# EAGLE schematic cpu (EAGLE 4.15), part 2 of 2
## Sheet 12 of 16
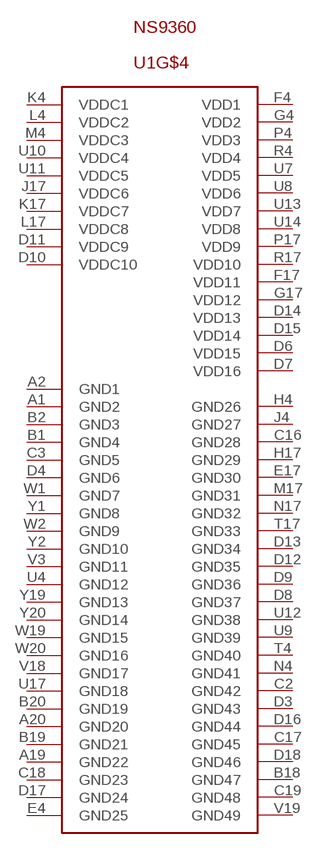
[diagram p12: schematic, sheet 12, part 1 of 2]
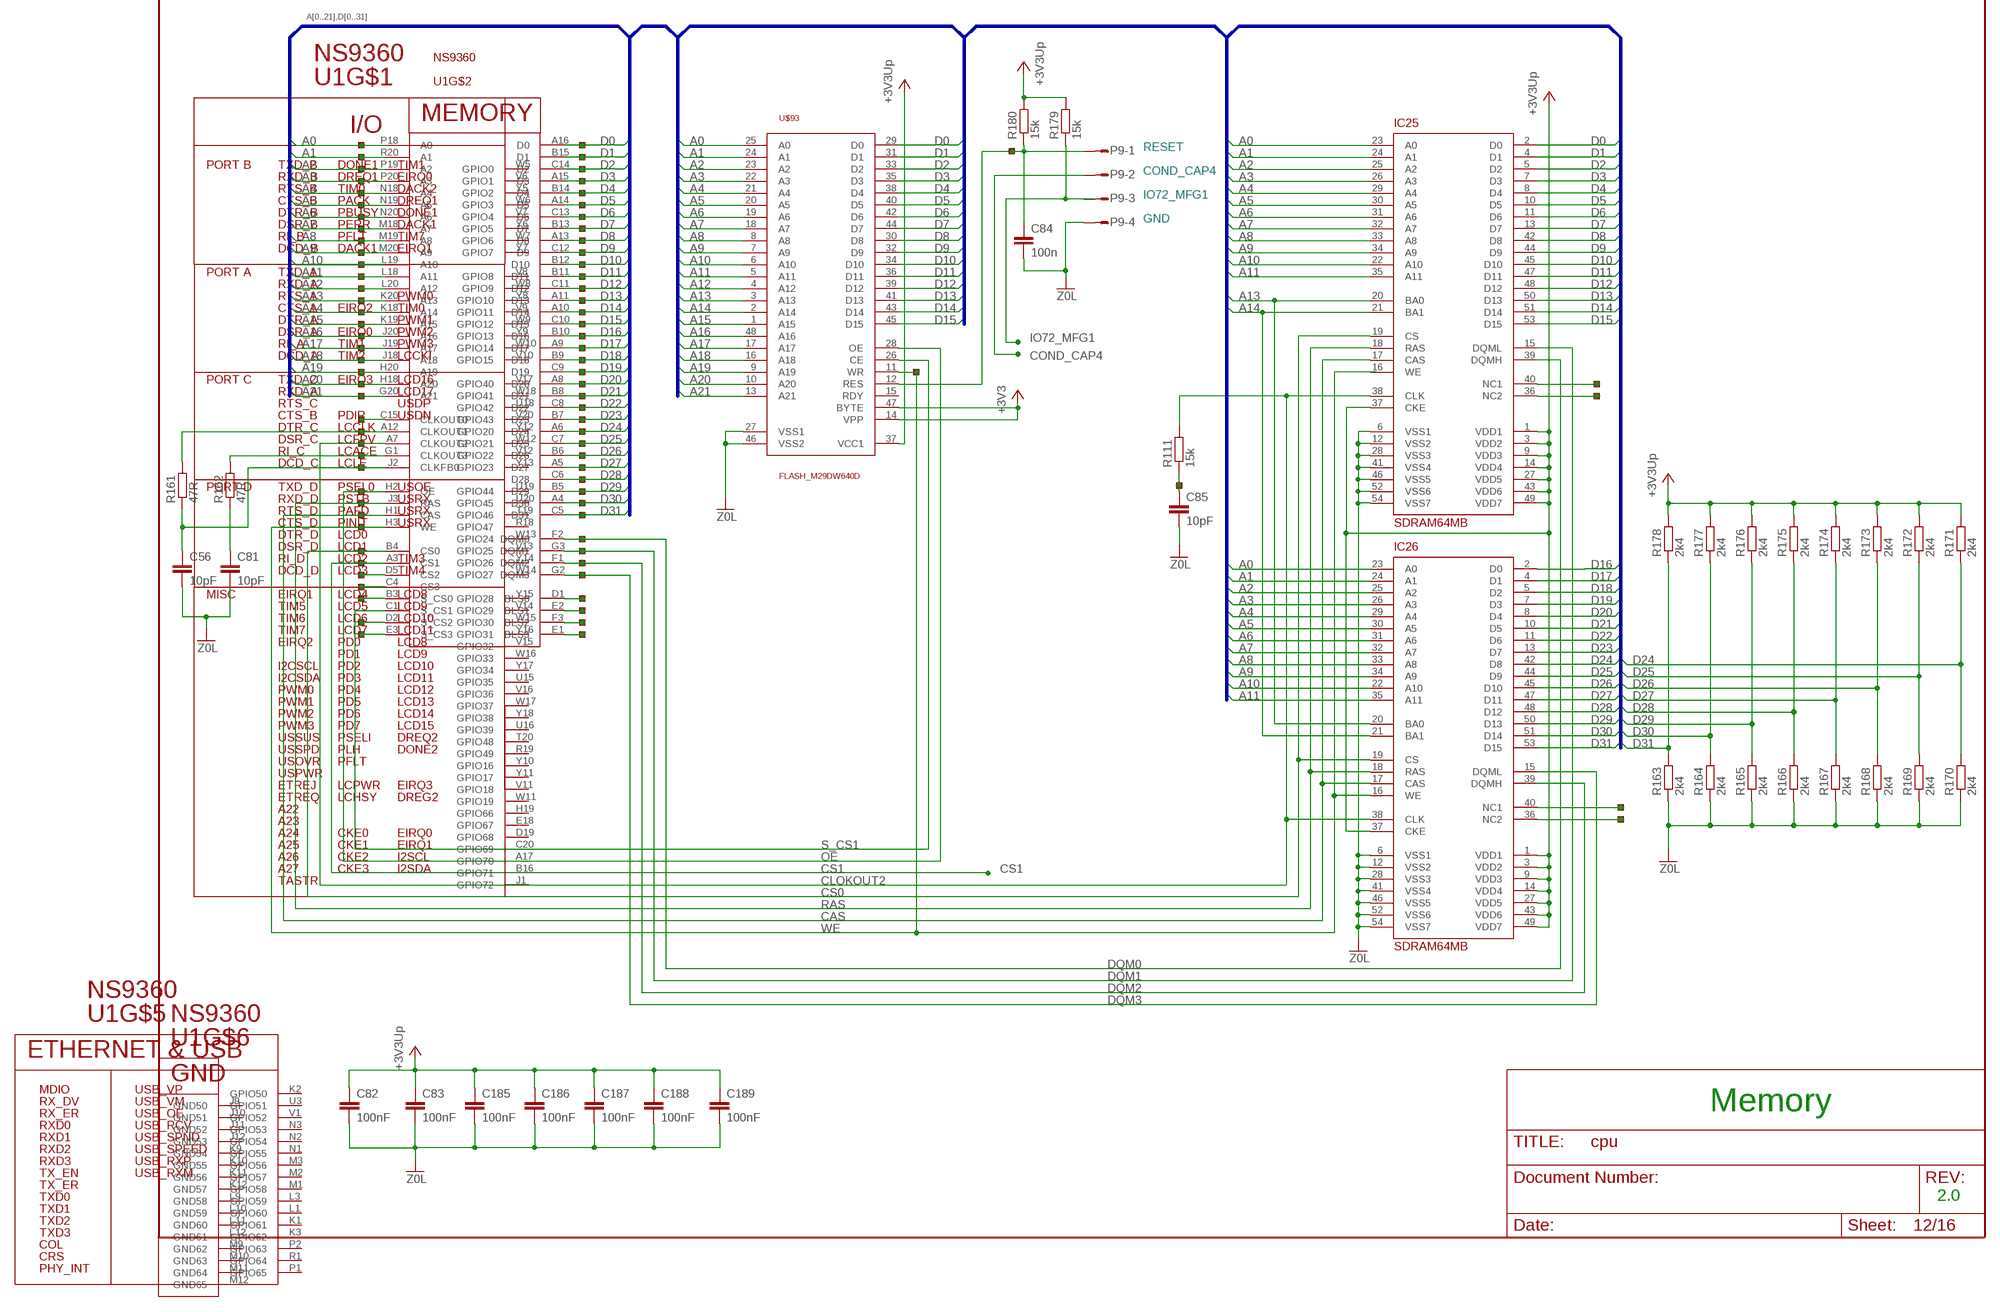
[diagram p13: schematic, sheet 12, part 2 of 2]

### Parts
C56  10pF  C-EUC0805K  [C0805K]
C81  10pF  C-EUC0805K  [C0805K]
C82  100nF  C-EUC0805K  [C0805K]
C83  100nF  C-EUC0805K  [C0805K]
C84  100n  C-EUC0805K  [C0805K]
C85  10pF  C-EUC0805K  [C0805K]
C185  100nF  C-EUC0805K  [C0805K]
C186  100nF  C-EUC0805K  [C0805K]
C187  100nF  C-EUC0805K  [C0805K]
C188  100nF  C-EUC0805K  [C0805K]
C189  100nF  C-EUC0805K  [C0805K]
IC25  SDRAM64MB  [TSOP54]
IC26  SDRAM64MB  [TSOP54]
P9  L04P  [L04P]
R111  15k  R-EU_R0805W  [R0805W]
R161  47R  R-EU_R0805W  [R0805W]
R162  47R  R-EU_R0805W  [R0805W]
R163  2k4  R-EU_R0805W  [R0805W]
R164  2k4  R-EU_R0805W  [R0805W]
R165  2k4  R-EU_R0805W  [R0805W]
R166  2k4  R-EU_R0805W  [R0805W]
R167  2k4  R-EU_R0805W  [R0805W]
R168  2k4  R-EU_R0805W  [R0805W]
R169  2k4  R-EU_R0805W  [R0805W]
R170  2k4  R-EU_R0805W  [R0805W]
R171  2k4  R-EU_R0805W  [R0805W]
R172  2k4  R-EU_R0805W  [R0805W]
R173  2k4  R-EU_R0805W  [R0805W]
R174  2k4  R-EU_R0805W  [R0805W]
R175  2k4  R-EU_R0805W  [R0805W]
R176  2k4  R-EU_R0805W  [R0805W]
R177  2k4  R-EU_R0805W  [R0805W]
R178  2k4  R-EU_R0805W  [R0805W]
R179  15k  R-EU_R0805W  [R0805W]
R180  15k  R-EU_R0805W  [R0805W]
U$93  FLASH_M29DW640D  [TSOP48]
U$149  TESTPAD  [TESTPAD]
U$162  TESTPAD  [TESTPAD]
U$258  TESTPAD  [TESTPAD]
U$263  TESTPAD  [TESTPAD]
U$265  TESTPAD  [TESTPAD]
U$273  TESTPAD  [TESTPAD]
U$275  TESTPAD  [TESTPAD]
U$284  TESTPAD  [TESTPAD]
U$303  TESTPAD  [TESTPAD]
U$304  TESTPAD  [TESTPAD]
U$305  TESTPAD  [TESTPAD]
U$306  TESTPAD  [TESTPAD]
U$309  TESTPAD  [TESTPAD]
U$333  TESTPAD  [TESTPAD]
U$371  TESTPAD  [TESTPAD]
U$372  TESTPAD  [TESTPAD]
U$376  TESTPAD  [TESTPAD]
U$382  TESTPAD  [TESTPAD]
U$385  TESTPAD  [TESTPAD]
U$399  TESTPAD  [TESTPAD]
U$402  TESTPAD  [TESTPAD]
U$403  TESTPAD  [TESTPAD]
U$404  TESTPAD  [TESTPAD]
U$405  TESTPAD  [TESTPAD]
U$406  TESTPAD  [TESTPAD]
U$407  TESTPAD  [TESTPAD]
U$412  TESTPAD  [TESTPAD]
U$423  TESTPAD  [TESTPAD]
U$424  TESTPAD  [TESTPAD]
U$425  TESTPAD  [TESTPAD]
U$426  TESTPAD  [TESTPAD]
U$427  TESTPAD  [TESTPAD]
U$428  TESTPAD  [TESTPAD]
U$429  TESTPAD  [TESTPAD]
U$430  TESTPAD  [TESTPAD]
U$431  TESTPAD  [TESTPAD]
U$432  TESTPAD  [TESTPAD]
U$433  TESTPAD  [TESTPAD]
U$434  TESTPAD  [TESTPAD]
U$435  TESTPAD  [TESTPAD]
U$441  TESTPAD  [TESTPAD]
U$447  TESTPAD  [TESTPAD]
U$448  TESTPAD  [TESTPAD]
U$449  TESTPAD  [TESTPAD]
U$453  TESTPAD  [TESTPAD]
U$454  TESTPAD  [TESTPAD]
U$457  TESTPAD  [TESTPAD]
U$458  TESTPAD  [TESTPAD]
U$459  TESTPAD  [TESTPAD]
U$462  TESTPAD  [TESTPAD]
U$469  TESTPAD  [TESTPAD]
U$470  TESTPAD  [TESTPAD]
U$471  TESTPAD  [TESTPAD]
U$472  TESTPAD  [TESTPAD]
U$473  TESTPAD  [TESTPAD]
U$474  TESTPAD  [TESTPAD]
U$476  TESTPAD  [TESTPAD]
U$481  TESTPAD  [TESTPAD]
U$482  TESTPAD  [TESTPAD]
U$483  TESTPAD  [TESTPAD]
U$486  TESTPAD  [TESTPAD]
U$487  TESTPAD  [TESTPAD]
U$488  TESTPAD  [TESTPAD]
U$489  TESTPAD  [TESTPAD]
U$490  TESTPAD  [TESTPAD]
U$493  TESTPAD  [TESTPAD]
U$510  TESTPAD  [TESTPAD]
U$554  TESTPAD  [TESTPAD]
U$556  TESTPAD  [TESTPAD]
U$569  TESTPAD  [TESTPAD]
U$570  TESTPAD  [TESTPAD]
U$571  TESTPAD  [TESTPAD]
U$572  TESTPAD  [TESTPAD]
U$573  TESTPAD  [TESTPAD]
U$574  TESTPAD  [TESTPAD]
U$575  TESTPAD  [TESTPAD]
U$588  TESTPAD  [TESTPAD]
U$589  TESTPAD  [TESTPAD]
U$590  TESTPAD  [TESTPAD]
U$591  TESTPAD  [TESTPAD]
U$592  TESTPAD  [TESTPAD]
U$593  TESTPAD  [TESTPAD]
U$594  TESTPAD  [TESTPAD]
U$595  TESTPAD  [TESTPAD]
U$596  TESTPAD  [TESTPAD]

### Nets
0V: C82.2 C83.2 C84.2 C185.2 C186.2 C187.2 C188.2 C189.2 IC25.6(VSS1) IC25.12(VSS2) IC25.28(VSS3) IC25.41(VSS4) IC25.46(VSS5) IC25.52(VSS6) IC25.54(VSS7) IC26.6(VSS1) IC26.12(VSS2) IC26.28(VSS3) IC26.41(VSS4) IC26.46(VSS5) IC26.52(VSS6) IC26.54(VSS7) P9.4 R163.1 R164.1 R165.1 R166.1 R167.1 R168.1 R169.1 R170.1 U$93.27(VSS1) U$93.46(VSS2) ; supply symbol labelled Z0L ; also sheet 2,3,4,5,6,7,8,9,10,11,13,14,15,16
+3V3: C82.1 C83.1 C185.1 C186.1 C187.1 C188.1 C189.1 IC25.1(VDD1) IC25.3(VDD2) IC25.9(VDD3) IC25.14(VDD4) IC25.27(VDD5) IC25.37(CKE) IC25.43(VDD6) IC25.49(VDD7) IC26.1(VDD1) IC26.3(VDD2) IC26.9(VDD3) IC26.14(VDD4) IC26.27(VDD5) IC26.37(CKE) IC26.43(VDD6) IC26.49(VDD7) R171.2 R172.2 R173.2 R174.2 R175.2 R176.2 R177.2 R178.2 R179.2 R180.2 U$93.14(VPP) U$93.37(VCC1) U$93.47(BYTE) ; supply symbol labelled +3V3Up ; also sheet 2,3,4,5,6,7,10,11,13,14,15,16
A0: IC25.23(A0) IC26.23(A0) U1.P18(A0) U$93.25(A0) U$441.1
A1: IC25.24(A1) IC26.24(A1) U1.R20(A1) U$93.24(A1) U$435.1
A2: IC25.25(A2) IC26.25(A2) U1.P19(A2) U$93.23(A2) U$434.1
A3: IC25.26(A3) IC26.26(A3) U1.P20(A3) U$93.22(A3) U$433.1
A4: IC25.29(A4) IC26.29(A4) U1.N18(A4) U$93.21(A4) U$432.1
A5: IC25.30(A5) IC26.30(A5) U1.N19(A5) U$93.20(A5) U$431.1
A6: IC25.31(A6) IC26.31(A6) U1.N20(A6) U$93.19(A6) U$430.1
A7: IC25.32(A7) IC26.32(A7) U1.M18(A7) U$93.18(A7) U$429.1
A8: IC25.33(A8) IC26.33(A8) U1.M19(A8) U$93.8(A8) U$428.1
A9: IC25.34(A9) IC26.34(A9) U1.M20(A9) U$93.7(A9) U$427.1
A10: IC25.22(A10) IC26.22(A10) U1.L19(A10) U$93.6(A10) U$426.1
A11: IC25.35(A11) IC26.35(A11) U1.L18(A11) U$93.5(A11) U$425.1
A12: U1.L20(A12) U$93.4(A12) U$424.1
A13: IC25.20(BA0) IC26.20(BA0) U1.K20(A13) U$93.3(A13) U$423.1
A14: IC25.21(BA1) IC26.21(BA1) U1.K18(A14) U$93.2(A14) U$412.1
A15: U1.K19(A15) U$93.1(A15) U$407.1
A16: U1.J20(A16) U$93.48(A16) U$406.1
A17: U1.J19(A17) U$93.17(A17) U$405.1
A18: U1.J18(A18) U$93.16(A18) U$404.1
A19: U1.H20(A19) U$93.9(A19) U$403.1
A20: U1.H18(A20) U$93.10(A20) U$402.1
A21: U1.G20(A21) U$93.13(A21) U$399.1
CAS: IC25.17(CAS) IC26.17(CAS) U1.H1(CAS) U$306.1
CLOKOUT2: IC25.38(CLK) IC26.38(CLK) R111.2 U1.A7(CLKOUT2) U$382.1
COND_CAP4: P9.2 ; also sheet 4,5
CS0: IC25.19(CS) IC26.19(CS) U1.B4(CS0) U$304.1
CS1: U1.A3(CS1) U$303.1 ; also sheet 5
D0: IC25.2(D0) U1.A16(D0) U$93.29(D0) U$447.1
D1: IC25.4(D1) U1.B15(D1) U$93.31(D1) U$489.1
D2: IC25.5(D2) U1.C14(D2) U$93.33(D2) U$488.1
D3: IC25.7(D3) U1.A15(D3) U$93.35(D3) U$487.1
D4: IC25.8(D4) U1.B14(D4) U$93.38(D4) U$486.1
D5: IC25.10(D5) U1.A14(D5) U$93.40(D5) U$483.1
D6: IC25.11(D6) U1.C13(D6) U$93.42(D6) U$482.1
D7: IC25.13(D7) U1.B13(D7) U$93.44(D7) U$481.1
D8: IC25.42(D8) U1.A13(D8) U$93.30(D8) U$476.1
D9: IC25.44(D9) U1.C12(D9) U$93.32(D9) U$474.1
D10: IC25.45(D10) U1.B12(D10) U$93.34(D10) U$473.1
D11: IC25.47(D11) U1.B11(D11) U$93.36(D11) U$472.1
D12: IC25.48(D12) U1.C11(D12) U$93.39(D12) U$471.1
D13: IC25.50(D13) U1.A11(D13) U$93.41(D13) U$470.1
D14: IC25.51(D14) U1.A10(D14) U$93.43(D14) U$469.1
D15: IC25.53(D15) U1.C10(D15) U$93.45(D15) U$462.1
D16: IC26.2(D0) U1.B10(D16) U$459.1
D17: IC26.4(D1) U1.A9(D17) U$458.1
D18: IC26.5(D2) U1.B9(D18) U$457.1
D19: IC26.7(D3) U1.C9(D19) U$454.1
D20: IC26.8(D4) U1.A8(D20) U$453.1
D21: IC26.10(D5) U1.B8(D21) U$449.1
D22: IC26.11(D6) U1.C8(D22) U$448.1
D23: IC26.13(D7) U1.B7(D23) U$490.1
D24: IC26.42(D8) R170.2 R171.1 U1.A6(D24) U$554.1
D25: IC26.44(D9) R169.2 R172.1 U1.C7(D25) U$556.1
D26: IC26.45(D10) R168.2 R173.1 U1.B6(D26) U$569.1
D27: IC26.47(D11) R167.2 R174.1 U1.A5(D27) U$570.1
D28: IC26.48(D12) R166.2 R175.1 U1.C6(D28) U$571.1
D29: IC26.50(D13) R165.2 R176.1 U1.B5(D29) U$572.1
D30: IC26.51(D14) R164.2 R177.1 U1.A4(D30) U$573.1
D31: IC26.53(D15) R163.2 R178.1 U1.C5(D31) U$574.1
DQM0: IC25.39(DQMH) U1.F2(DQM0) U$575.1
DQM1: IC25.15(DQML) U1.G3(DQM1) U$588.1
DQM2: IC26.39(DQMH) U1.F1(DQM2) U$589.1
DQM3: IC26.15(DQML) U1.G2(DQM3) U$590.1
IO72_MFG1: P9.3 R179.1 ; also sheet 5
N$176: R111.1 U$309.1
N$204: C84.1 P9.1 R180.1 U$93.12(RES) U$596.1
N$205: C81.1 R162.1
N$217: R161.1 U1.J2(CLKFB0) U$372.1
N$220: R161.2 U1.A12(CLKOUT1) U$385.1
N$221: R162.2 U1.G1(CLKOUT3) U$376.1
N$359: U1.C15(CLKOUT0) U$275.1
N$360: U1.D5(CS2) U$284.1
N$361: U1.C4(CS3) U$273.1
N$362: U1.B3(S_CS0) U$265.1
N$363: U1.D2(S_CS2) U$263.1
N$364: U1.E3(S_CS3) U$258.1
N$365: U1.D1(BLS0) U$591.1
N$366: U1.E2(BLS1) U$592.1
N$367: U1.F3(BLS2) U$593.1
N$368: U1.E1(BLS3) U$594.1
N$369: IC26.40(NC1) U$493.1
N$370: IC26.36(NC2) U$510.1
N$371: IC25.40(NC1) U$149.1
N$372: IC25.36(NC2) U$162.1
OE: U1.H2(OE) U$93.28(OE) U$371.1
RAS: IC25.18(RAS) IC26.18(RAS) U1.J3(RAS) U$333.1
S_CS1: U1.C1(S_CS1) U$93.26(CE)
WE: IC26.16(WE) U1.H3(WE) U$93.11(WR) U$305.1 U$595.1
Unconnected: C56.1 C56.2 C81.2 C85.1 C85.2 IC25.16(WE) U$93.15(RDY)

### Buses
A[0..21],D[0..31]

### Notes on the sheet
- RESET
- COND_CAP4
- IO72_MFG1
- GND
- Memory
- 2.0

## Sheet 13 of 16
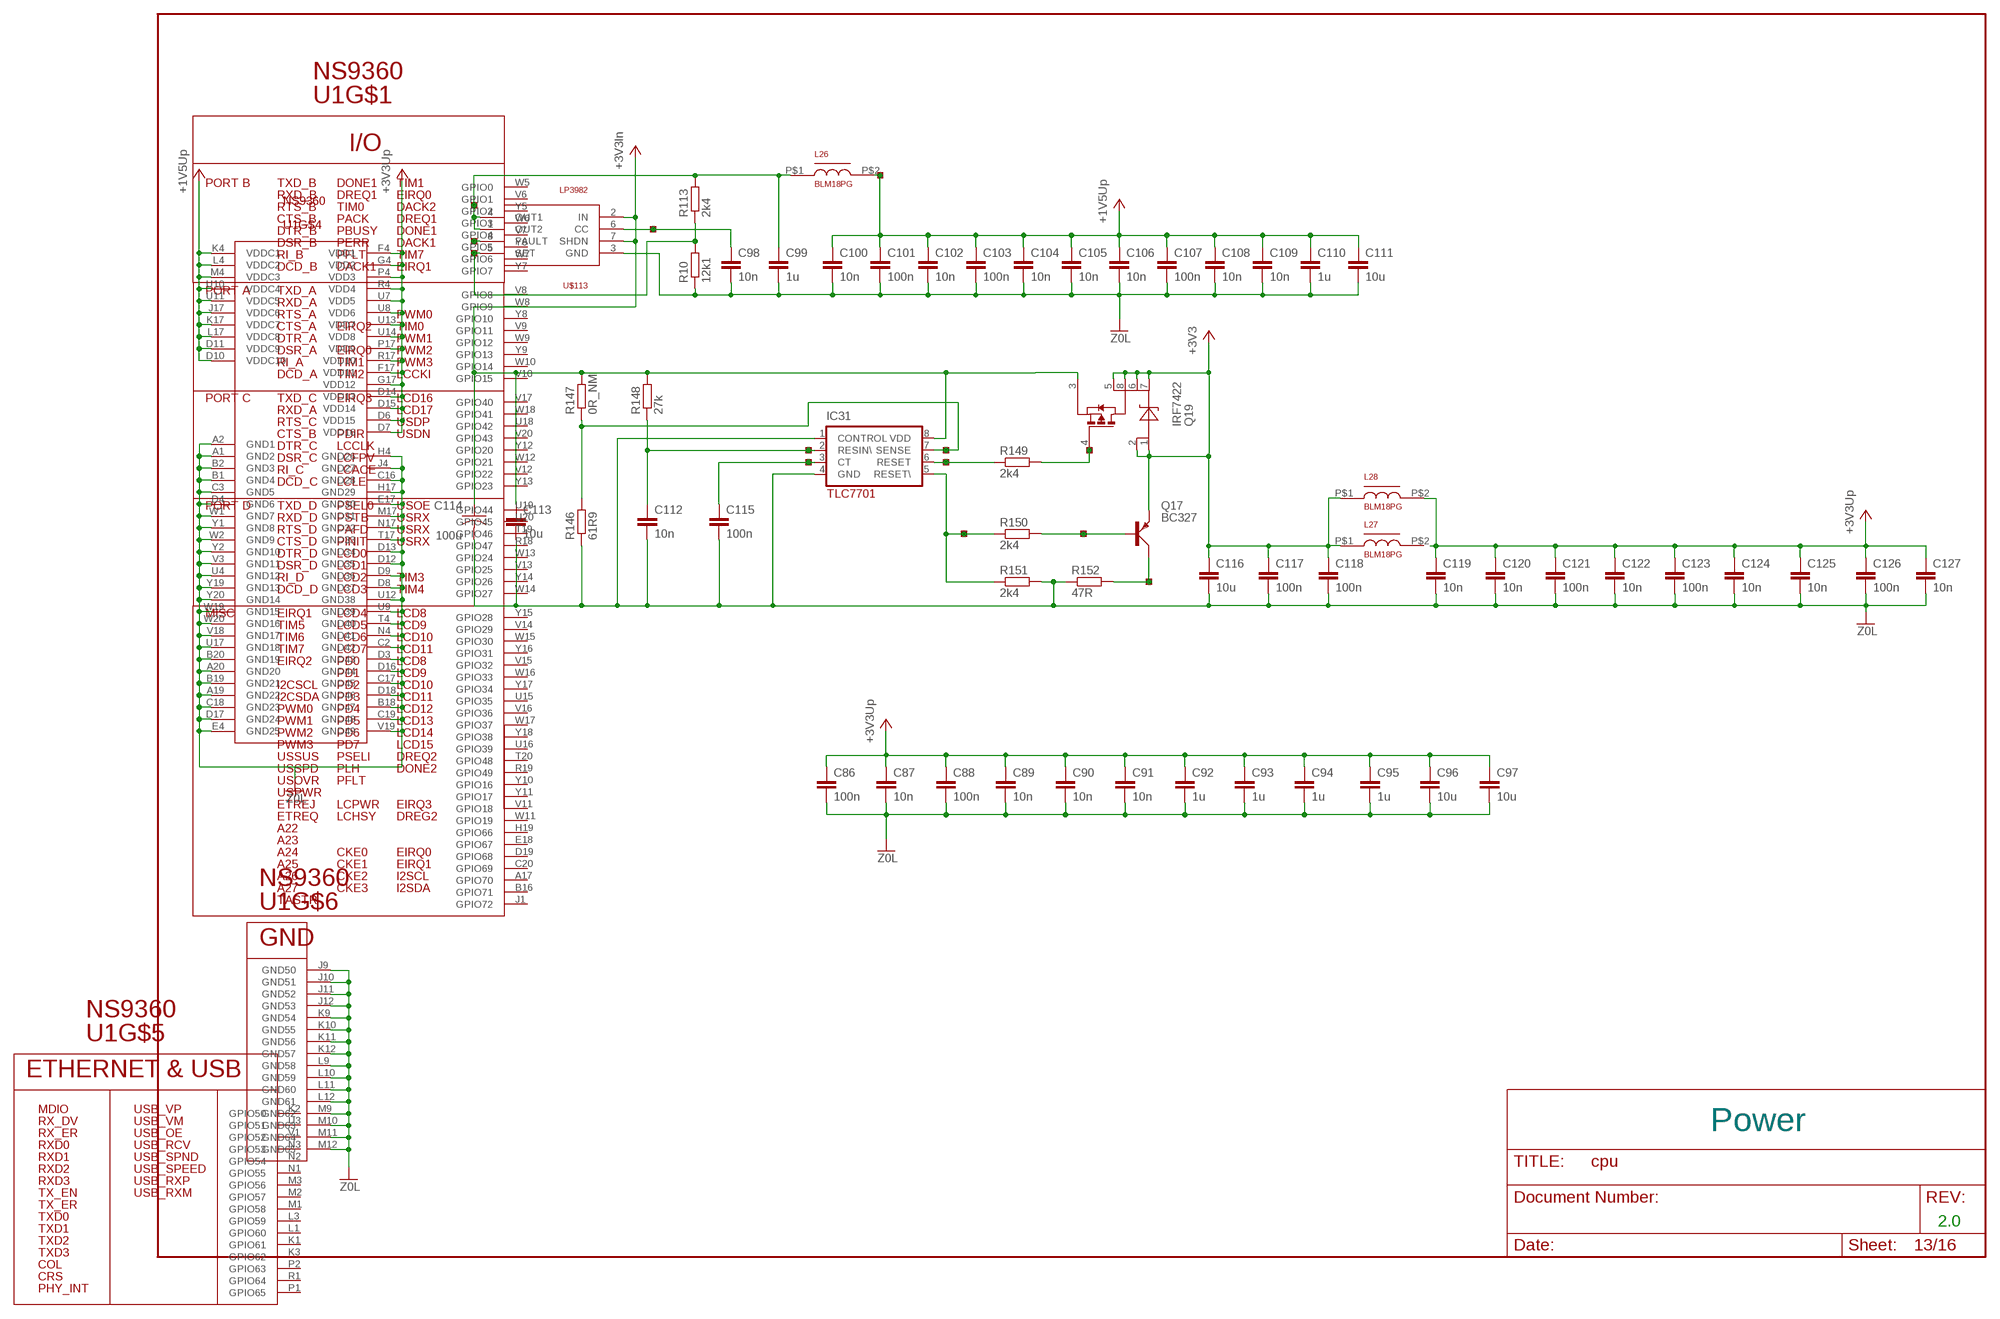
[diagram p14: schematic, sheet 13]

### Parts
C86  100n  C-EUC0805K  [C0805K]
C87  10n  C-EUC0805K  [C0805K]
C88  100n  C-EUC0805K  [C0805K]
C89  10n  C-EUC0805K  [C0805K]
C90  10n  C-EUC0805K  [C0805K]
C91  10n  C-EUC0805K  [C0805K]
C92  1u  C-EUC0805K  [C0805K]
C93  1u  C-EUC0805K  [C0805K]
C94  1u  C-EUC0805K  [C0805K]
C95  1u  C-EUC0805K  [C0805K]
C96  10u  C-EUC0805K  [C0805K]
C97  10u  C-EUC0805K  [C0805K]
C98  10n  C-EUC0805K  [C0805K]
C99  1u  C-EUC0805K  [C0805K]
C100  10n  C-EUC0805K  [C0805K]
C101  100n  C-EUC0805K  [C0805K]
C102  10n  C-EUC0805K  [C0805K]
C103  100n  C-EUC0805K  [C0805K]
C104  10n  C-EUC0805K  [C0805K]
C105  10n  C-EUC0805K  [C0805K]
C106  10n  C-EUC0805K  [C0805K]
C107  100n  C-EUC0805K  [C0805K]
C108  10n  C-EUC0805K  [C0805K]
C109  10n  C-EUC0805K  [C0805K]
C110  1u  C-EUC0805K  [C0805K]
C111  10u  C-EUC0805K  [C0805K]
C112  10n  C-EUC0805K  [C0805K]
C113  10u  C-EUC0805K  [C0805K]
C114  100u  CAP2.5  [CAP2.5]
C115  100n  C-EUC0805K  [C0805K]
C116  10u  C-EUC0805K  [C0805K]
C117  100n  C-EUC0805K  [C0805K]
C118  100n  C-EUC0805K  [C0805K]
C119  10n  C-EUC0805K  [C0805K]
C120  10n  C-EUC0805K  [C0805K]
C121  100n  C-EUC0805K  [C0805K]
C122  10n  C-EUC0805K  [C0805K]
C123  100n  C-EUC0805K  [C0805K]
C124  10n  C-EUC0805K  [C0805K]
C125  10n  C-EUC0805K  [C0805K]
C126  100n  C-EUC0805K  [C0805K]
C127  10n  C-EUC0805K  [C0805K]
IC31  TLC7701  TLC77XX  [SO8]
L26  BLM18PG  IND_BLM  [IND_BLM]
L27  BLM18PG  IND_BLM  [IND_BLM]
L28  BLM18PG  IND_BLM  [IND_BLM]
Q17  BC327  [SOT54A]
Q19  IRF7422  [SO8]
R10  12k1  R-EU_R0805W  [R0805W]
R113  2k4  R-EU_R0805W  [R0805W]
R146  61R9  R-EU_R0805W  [R0805W]
R147  0R_NM  R-EU_R0805W  [R0805W]
R148  27k  R-EU_R0805W  [R0805W]
R149  2k4  R-EU_R0805W  [R0805W]
R150  2k4  R-EU_R0805W  [R0805W]
R151  2k4  R-EU_R0805W  [R0805W]
R152  47R  R-EU_R0805W  [R0805W]
U$113  LP3982  [MSOP8]
U$597  TESTPAD  [TESTPAD]
U$598  TESTPAD  [TESTPAD]
U$599  TESTPAD  [TESTPAD]
U$600  TESTPAD  [TESTPAD]
U$601  TESTPAD  [TESTPAD]
U$602  TESTPAD  [TESTPAD]
U$603  TESTPAD  [TESTPAD]
U$604  TESTPAD  [TESTPAD]
U$605  TESTPAD  [TESTPAD]
U$606  TESTPAD  [TESTPAD]
U$607  TESTPAD  [TESTPAD]
U$608  TESTPAD  [TESTPAD]
U$609  TESTPAD  [TESTPAD]

### Nets
0V: C86.2 C93.2 C94.2 C95.2 C96.2 C97.2 C99.2 C100.2 C101.2 C102.2 C103.2 C104.2 C105.2 C106.2 C107.2 C108.2 C109.2 C110.2 C111.2 C112.2 C113.2 C114.2 C115.2 C116.2 C117.2 C118.2 C119.2 C120.2 C121.2 C122.2 C123.2 C124.2 C125.2 C126.2 C127.2 IC31.1(CONTROL) IC31.4(GND) R10.1 R146.1 R151.2 R152.1 U1.A1(GND2) U1.A2(GND1) U1.A19(GND22) U1.A20(GND20) U1.B1(GND4) U1.B2(GND3) U1.B18(GND47) U1.B19(GND21) U1.B20(GND19) U1.C2(GND42) U1.C3(GND5) U1.C16(GND28) U1.C17(GND45) U1.C18(GND23) U1.C19(GND48) U1.D3(GND43) U1.D4(GND6) U1.D8(GND37) U1.D9(GND36) U1.D12(GND35) U1.D13(GND34) U1.D16(GND44) U1.D17(GND24) U1.D18(GND46) U1.E4(GND25) U1.E17(GND30) U1.H4(GND26) U1.H17(GND29) U1.J4(GND27) U1.J9(GND50) U1.J10(GND51) U1.J11(GND52) U1.J12(GND53) U1.K9(GND54) U1.K10(GND55) U1.K11(GND56) U1.K12(GND57) U1.L9(GND58) U1.L10(GND59) U1.L11(GND60) U1.L12(GND61) U1.M9(GND62) U1.M10(GND63) U1.M11(GND64) U1.M12(GND65) U1.M17(GND31) U1.N4(GND41) U1.N17(GND32) U1.T4(GND40) U1.T17(GND33) U1.U4(GND12) U1.U9(GND39) U1.U12(GND38) U1.U17(GND18) U1.V3(GND11) U1.V18(GND17) U1.V19(GND49) U1.W1(GND7) U1.W2(GND9) U1.W19(GND15) U1.W20(GND16) U1.Y1(GND8) U1.Y2(GND10) U1.Y19(GND13) U1.Y20(GND14) U$113.3(GND) ; supply symbol labelled Z0L ; also sheet 2,3,4,5,6,7,8,9,10,11,12,14,15,16
+3V3: C86.1 C93.1 C94.1 C95.1 C96.1 C97.1 C100.1 C101.1 C102.1 C103.1 C104.1 C105.1 C106.1 C107.1 C108.1 C109.1 C110.1 C111.1 C113.1 C114.1 C116.1 C117.1 C118.1 C119.1 C120.1 C121.1 C122.1 C123.1 C124.1 C125.1 C126.1 C127.1 IC31.8(VDD) L26.P$2 L27.P$1 L28.P$1 L28.P$2 Q17.E Q19.1 Q19.2 Q19.3 Q19.5 Q19.6 Q19.7 Q19.8 R147.2 R148.2 U1.D6(VDD15) U1.D7(VDD16) U1.D10(VDDC10) U1.D11(VDDC9) U1.D14(VDD13) U1.D15(VDD14) U1.F4(VDD1) U1.F17(VDD11) U1.G4(VDD2) U1.G17(VDD12) U1.J17(VDDC6) U1.K4(VDDC1) U1.K17(VDDC7) U1.L4(VDDC2) U1.L17(VDDC8) U1.M4(VDDC3) U1.P4(VDD3) U1.P17(VDD9) U1.R4(VDD4) U1.R17(VDD10) U1.U7(VDD5) U1.U8(VDD6) U1.U10(VDDC4) U1.U11(VDDC5) U1.U13(VDD7) U1.U14(VDD8) U$113.2(IN) U$113.7(SHDN) U$601.1 ; supply symbol labelled +3V3Up, +1V5Up, +3V3In ; also sheet 2,3,4,5,6,7,10,11,12,14,15,16
N$178: U$113.6(CC) U$600.1
N$179: C99.1 L26.P$1 R113.2 U$113.1(OUT2) U$113.4(OUT1) U$597.1
N$200: R10.2 R113.1 U$113.5(SET) U$599.1
N$201: IC31.7(SENSE) R146.2 R147.1 U$606.1
N$202: C112.1 IC31.2(RESIN\) R148.1 U$608.1
N$203: Q19.4 R149.2 U$605.1
N$206: IC31.5(RESET\) R150.1 R151.1 U$603.1
N$207: Q17.C R152.2 U$604.1
N$208: IC31.6(RESET) R149.1 U$607.1
N$209: Q17.B R150.2 U$602.1
N$210: C115.1 IC31.3(CT) U$609.1
N$354: U$113.8(FAULT) U$598.1
Unconnected: C87.1 C87.2 C88.1 C88.2 C89.1 C89.2 C90.1 C90.2 C91.1 C91.2 C92.1 C92.2 C98.1 C98.2 L27.P$2

### Notes on the sheet
- Power
- 2.0

## Sheet 14 of 16
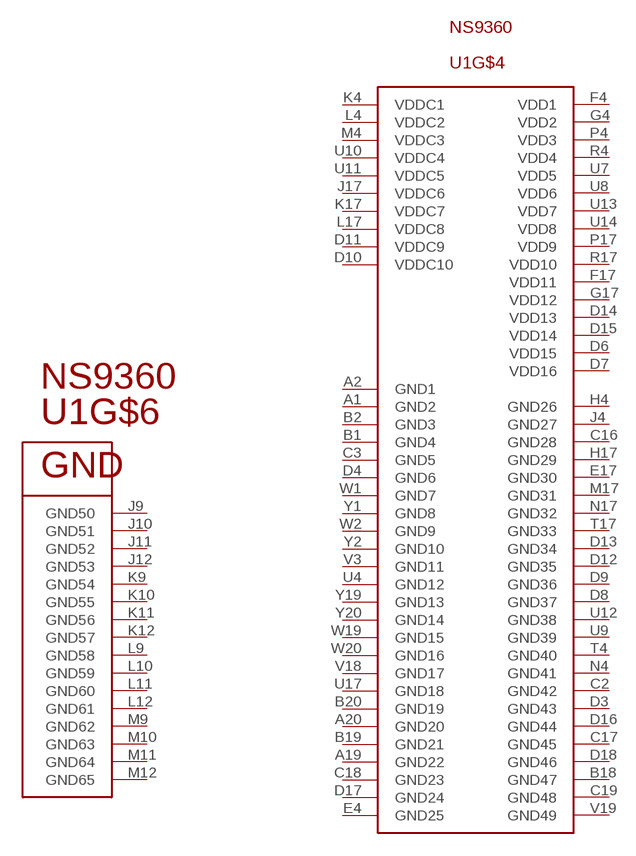
[diagram p15: schematic, sheet 14, part 1 of 2]
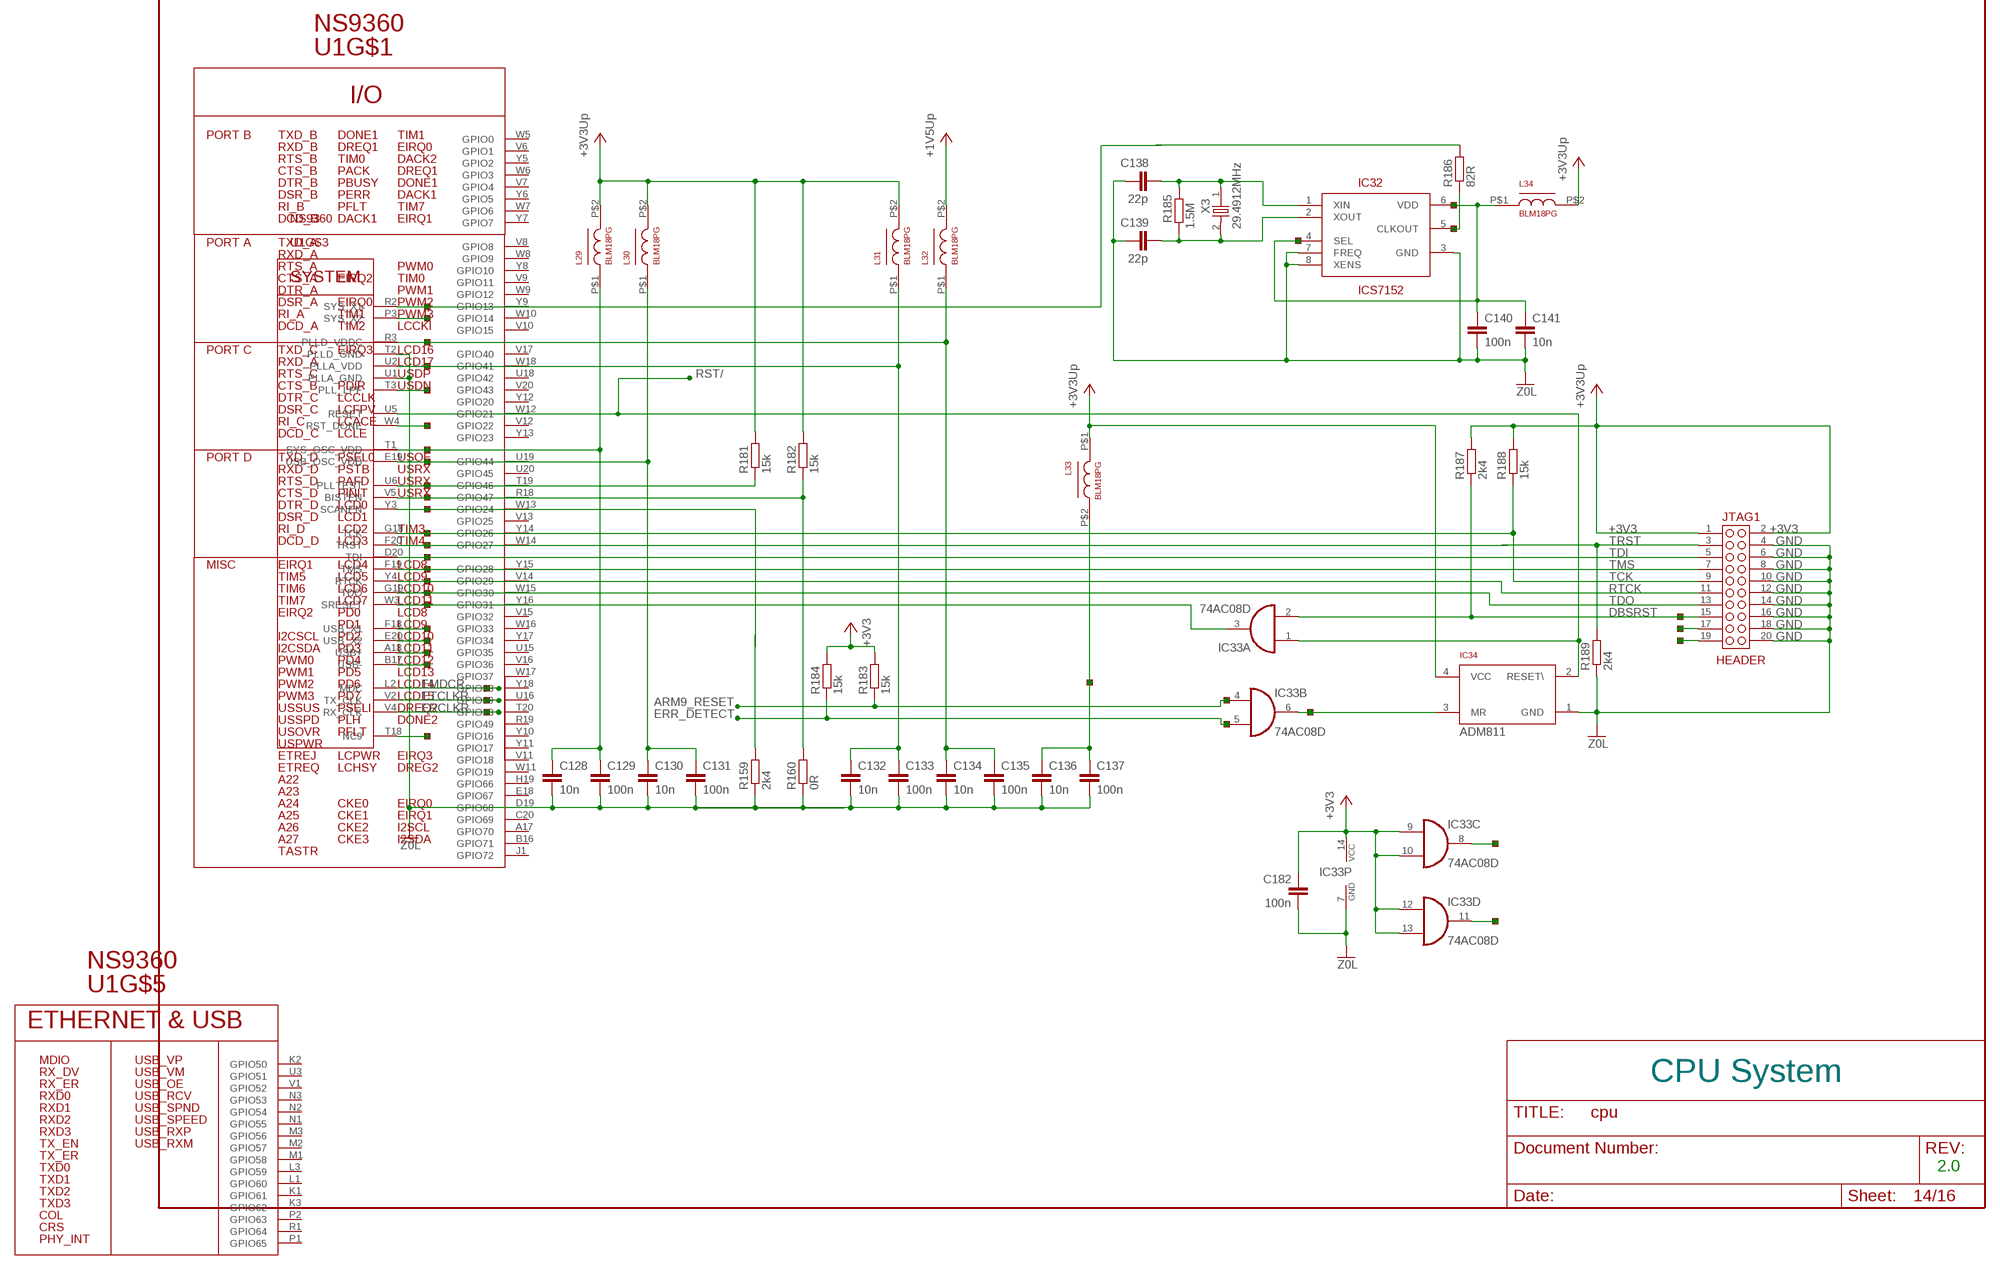
[diagram p16: schematic, sheet 14, part 2 of 2]

### Parts
C128  10n  C-EUC0805K  [C0805K]
C129  100n  C-EUC0805K  [C0805K]
C130  10n  C-EUC0805K  [C0805K]
C131  100n  C-EUC0805K  [C0805K]
C132  10n  C-EUC0805K  [C0805K]
C133  100n  C-EUC0805K  [C0805K]
C134  10n  C-EUC0805K  [C0805K]
C135  100n  C-EUC0805K  [C0805K]
C136  10n  C-EUC0805K  [C0805K]
C137  100n  C-EUC0805K  [C0805K]
C138  22p  C-EUC0805K  [C0805K]
C139  22p  C-EUC0805K  [C0805K]
C140  100n  C-EUC0805K  [C0805K]
C141  10n  C-EUC0805K  [C0805K]
C182  100n  C-EUC0805K  [C0805K]
IC32  ICS7152  [SO8]
IC33  74AC08D  [SO14]
IC34  ADM811  [ADM811]
JTAG1  HEADER  JTAG_HEADER  [JTAG_HEADER]
L29  BLM18PG  IND_BLM  [IND_BLM]
L30  BLM18PG  IND_BLM  [IND_BLM]
L31  BLM18PG  IND_BLM  [IND_BLM]
L32  BLM18PG  IND_BLM  [IND_BLM]
L33  BLM18PG  IND_BLM  [IND_BLM]
L34  BLM18PG  IND_BLM  [IND_BLM]
R159  2k4  R-EU_R0805W  [R0805W]
R160  0R  R-EU_R0805W  [R0805W]
R181  15k  R-EU_R0805W  [R0805W]
R182  15k  R-EU_R0805W  [R0805W]
R183  15k  R-EU_R0805W  [R0805W]
R184  15k  R-EU_R0805W  [R0805W]
R185  1.5M  R-EU_R0805W  [R0805W]
R186  82R  R-EU_R0805W  [R0805W]
R187  2k4  R-EU_R0805W  [R0805W]
R188  15k  R-EU_R0805W  [R0805W]
R189  2k4  R-EU_R0805W  [R0805W]
U$244  TESTPAD  [TESTPAD]
U$247  TESTPAD  [TESTPAD]
U$316  TESTPAD  [TESTPAD]
U$610  TESTPAD  [TESTPAD]
U$611  TESTPAD  [TESTPAD]
U$612  TESTPAD  [TESTPAD]
U$613  TESTPAD  [TESTPAD]
U$614  TESTPAD  [TESTPAD]
U$615  TESTPAD  [TESTPAD]
U$616  TESTPAD  [TESTPAD]
U$617  TESTPAD  [TESTPAD]
U$618  TESTPAD  [TESTPAD]
U$619  TESTPAD  [TESTPAD]
U$620  TESTPAD  [TESTPAD]
U$621  TESTPAD  [TESTPAD]
U$622  TESTPAD  [TESTPAD]
U$623  TESTPAD  [TESTPAD]
U$624  TESTPAD  [TESTPAD]
U$625  TESTPAD  [TESTPAD]
U$626  TESTPAD  [TESTPAD]
U$627  TESTPAD  [TESTPAD]
U$628  TESTPAD  [TESTPAD]
U$629  TESTPAD  [TESTPAD]
U$630  TESTPAD  [TESTPAD]
U$631  TESTPAD  [TESTPAD]
U$632  TESTPAD  [TESTPAD]
U$633  TESTPAD  [TESTPAD]
U$634  TESTPAD  [TESTPAD]
U$635  TESTPAD  [TESTPAD]
U$636  TESTPAD  [TESTPAD]
U$638  TESTPAD  [TESTPAD]
U$639  TESTPAD  [TESTPAD]
U$640  TESTPAD  [TESTPAD]
U$641  TESTPAD  [TESTPAD]
U$642  TESTPAD  [TESTPAD]
U$643  TESTPAD  [TESTPAD]
U$644  TESTPAD  [TESTPAD]
U$645  TESTPAD  [TESTPAD]
X3  29.4912MHz  HC49_4H_SMX  [HC49_4H_SMX]

### Nets
0V: C129.2 C130.2 C131.2 C132.2 C133.2 C134.2 C135.2 C136.2 C137.2 C138.2 C139.2 C140.2 C141.2 C182.2 IC32.3(GND) IC32.7(FREQ) IC32.8(XENS) IC33.7(P:GND) R159.1 R160.1 U1.T2(PLLD_GND) U1.U1(PLLA_GND) ; supply symbol labelled Z0L ; also sheet 2,3,4,5,6,7,8,9,10,11,12,13,15,16
+3V3: C129.1 C132.1 C133.1 C182.1 IC33.9(C:I0) IC33.10(C:I1) IC33.12(D:I0) IC33.13(D:I1) IC33.14(P:VCC) IC34.4(VCC) JTAG1.1 JTAG1.2 L29.P$1 L29.P$2 L30.P$2 L31.P$1 L31.P$2 L32.P$2 L33.P$1 L34.P$2 R181.2 R182.2 R183.2 R184.2 R187.2 R188.2 U1.T1(SYS_OSC_VDD) U1.U2(PLLA_VDD) U$629.1 U$632.1 ; supply symbol labelled +3V3Up, +1V5Up ; also sheet 2,3,4,5,6,7,10,11,12,13,15,16
ARM9_RESET: IC33.4(B:I0) R183.1 U$640.1 ; also sheet 10
DBSRST: IC33.2(A:I1) JTAG1.15 R187.1 U$642.1
EMDCR: U1.L2(MDC) U$613.1 ; also sheet 15
ERCLKR: U1.V4(RX_CLK) U$611.1 ; also sheet 15
ERR_DETECT: IC33.5(B:I1) R184.1 U$641.1 ; also sheet 5
ETCLKR: U1.V2(TX_CLK) U$612.1 ; also sheet 15
GND: IC34.1(GND) JTAG1.4 JTAG1.6 JTAG1.8 JTAG1.10 JTAG1.12 JTAG1.14 JTAG1.16 JTAG1.18 JTAG1.20 R189.1 ; supply symbol labelled Z0L
N$211: C130.1 C131.1 L30.P$1 U1.E19(USB_OSC_VDD) U$628.1
N$212: R159.2 U1.Y3(SCANEN) U$625.1
N$213: R160.2
N$214: R182.1 U1.V5(BISTEN) U$626.1
N$215: IC33.6(B:O) IC34.3(MR) U$639.1
N$216: R181.1 U1.U6(PLLTEST) U$627.1
N$218: C134.1 C135.1 L32.P$1 U1.R3(PLLD_VDDC) U$635.1
N$240: IC33.3(A:O) U1.W3(SRESET) U$618.1
N$241: C136.1 C137.1 L33.P$2 U$638.1
N$244: R186.2 U1.R2(SYS_X1) U$636.1
N$245: IC32.5(CLKOUT) R186.1 U$644.1
N$246: C140.1 C141.1 IC32.4(SEL) IC32.6(VDD) L34.P$1 U$643.1 U$645.1
N$247: C138.1 IC32.1(XIN) R185.2 X3.1
N$248: C139.1 IC32.2(XOUT) R185.1 X3.2
N$344: U1.P3(SYS_X2) U$634.1
N$345: U1.T3(PLL_LPF) U$631.1
N$346: U1.W4(RST_DONE) U$630.1
N$347: U1.F18(USB_X1) U$617.1
N$348: U1.E20(USB_X2) U$616.1
N$349: U1.A18(USB+) U$615.1
N$350: U1.B17(USB-) U$614.1
N$351: U1.T18(NC9) U$610.1
N$352: IC33.8(C:O) U$633.1
N$353: IC33.11(D:O) U$316.1
N$357: JTAG1.17 U$247.1
N$358: JTAG1.19 U$244.1
RST1: IC33.1(A:I0) IC34.2(RESET\)
RST/: U1.U5(RESET) ; also sheet 15
RTCK: JTAG1.11 U1.Y4(RTCK) U$620.1
TCK: JTAG1.9 R188.1 U1.G18(TCK) U$624.1
TDI: JTAG1.5 U1.D20(TDI) U$622.1
TDO: JTAG1.13 U1.G19(TDO) U$619.1
TMS: JTAG1.7 U1.F19(TMS) U$621.1
TRST: JTAG1.3 R189.2 U1.F20(TRST) U$623.1
Unconnected: C128.1 C128.2

### Notes on the sheet
- CPU System
- 2.0

## Sheet 15 of 16
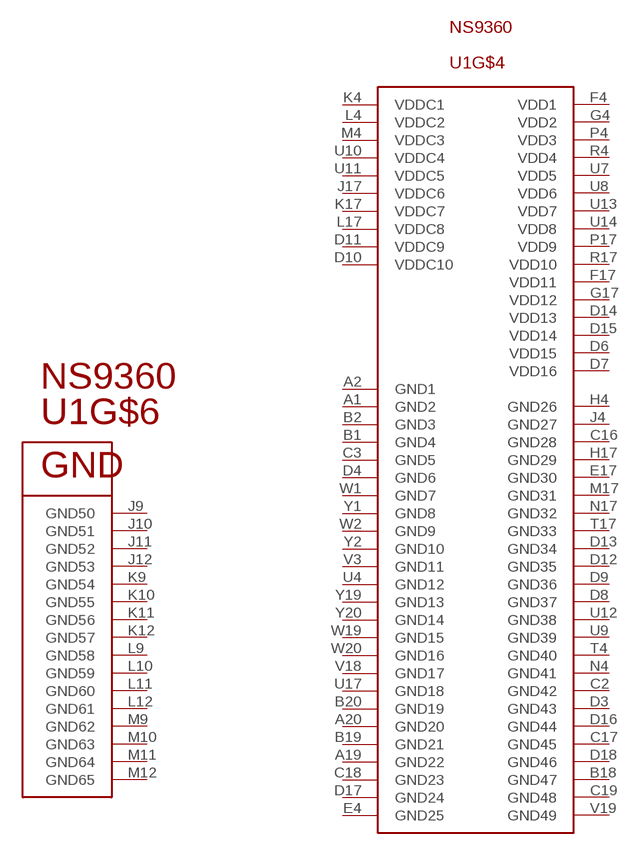
[diagram p17: schematic, sheet 15, part 1 of 2]
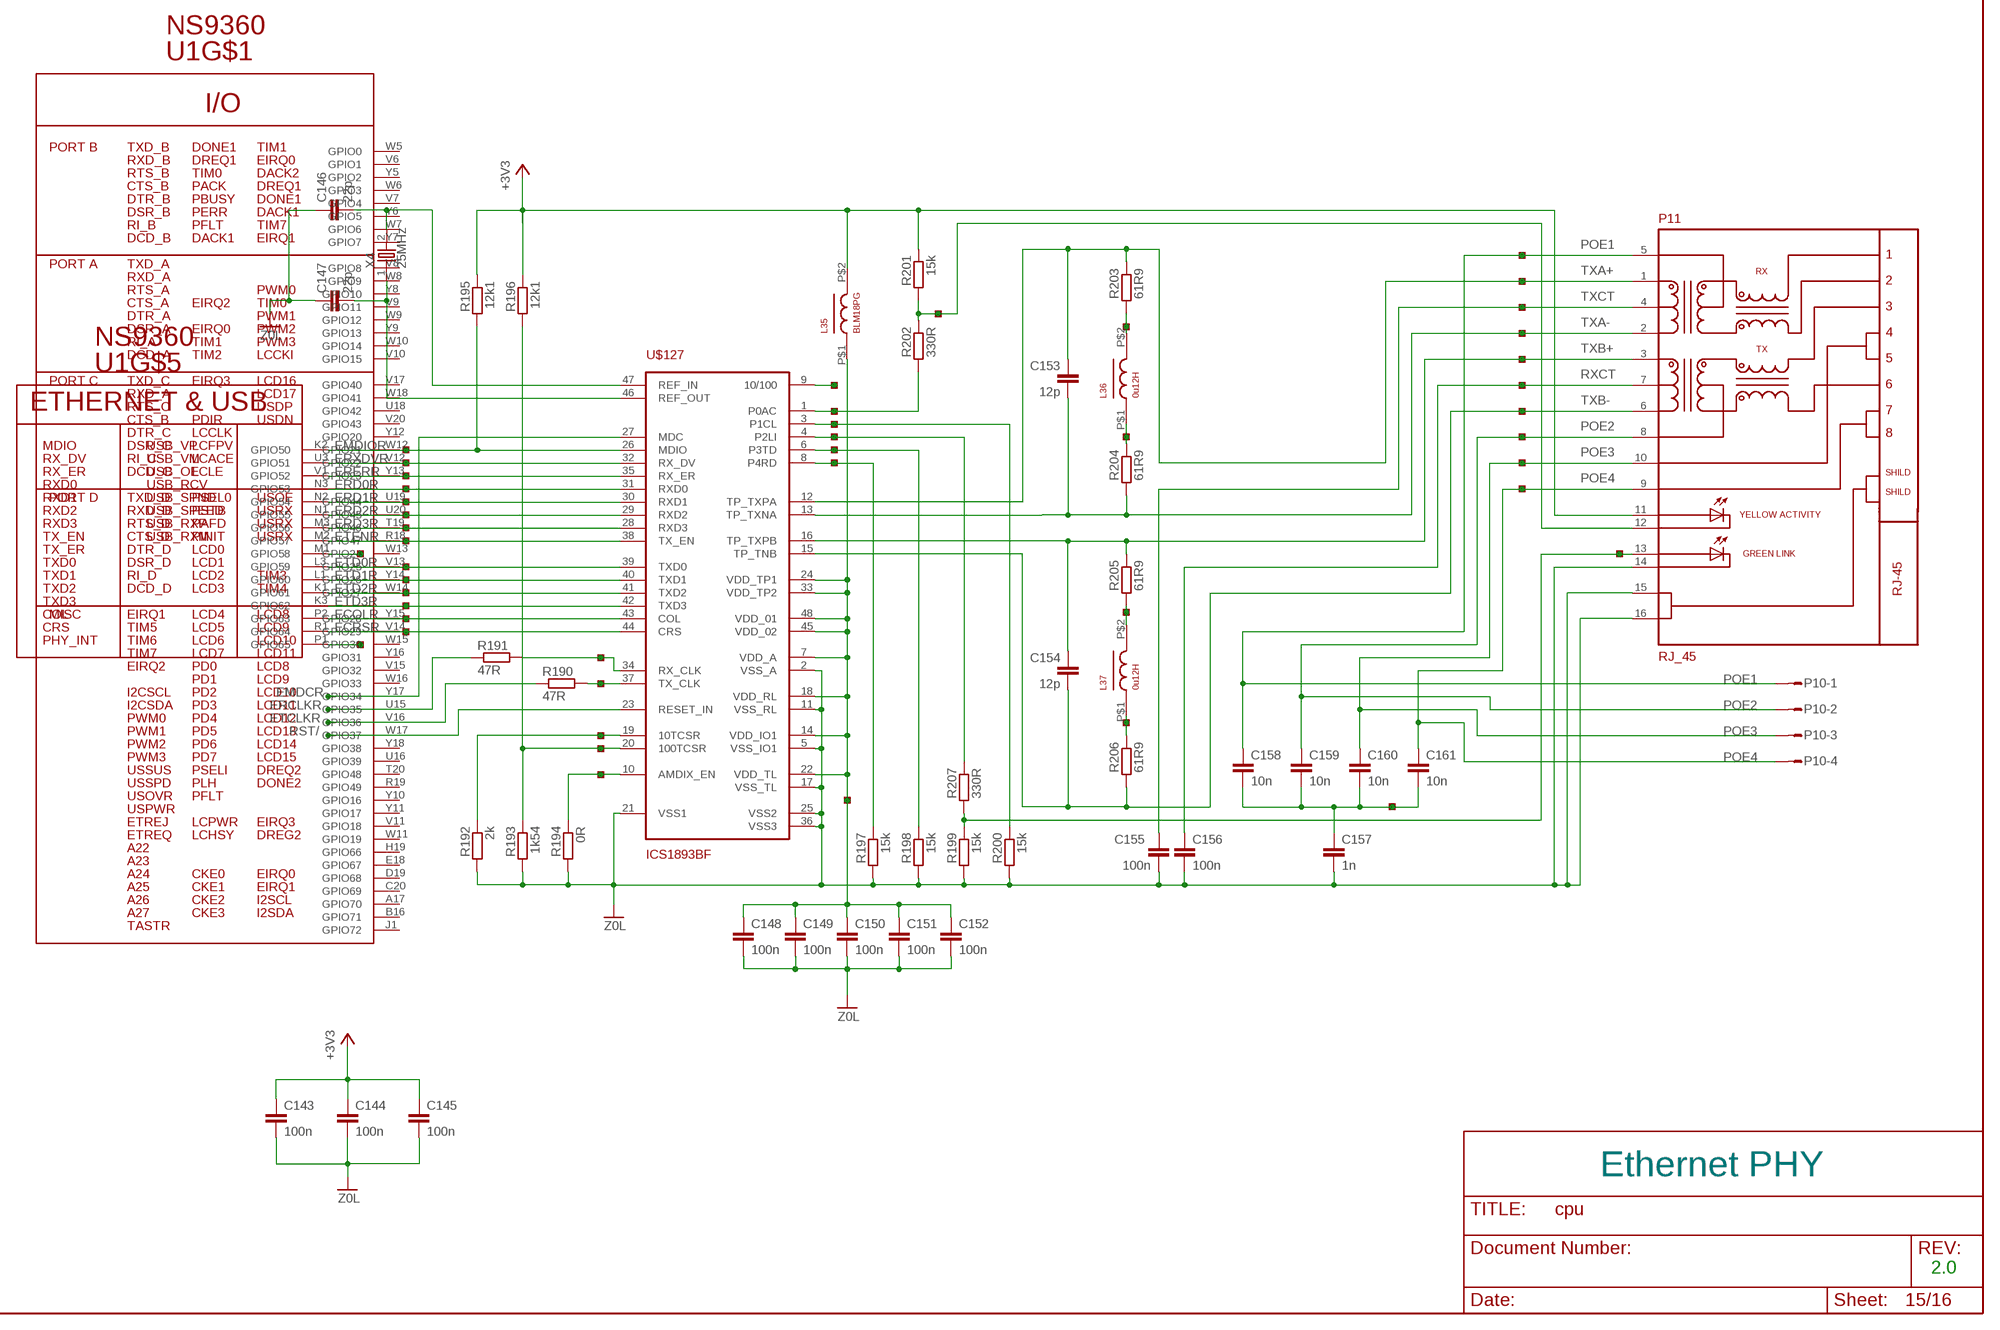
[diagram p18: schematic, sheet 15, part 2 of 2]

### Parts
C143  100n  C-EUC0805K  [C0805K]
C144  100n  C-EUC0805K  [C0805K]
C145  100n  C-EUC0805K  [C0805K]
C146  22p  C-EUC0805K  [C0805K]
C147  22p  C-EUC0805K  [C0805K]
C148  100n  C-EUC0805K  [C0805K]
C149  100n  C-EUC0805K  [C0805K]
C150  100n  C-EUC0805K  [C0805K]
C151  100n  C-EUC0805K  [C0805K]
C152  100n  C-EUC0805K  [C0805K]
C153  12p  C-EUC0805K  [C0805K]
C154  12p  C-EUC0805K  [C0805K]
C155  100n  C-EUC0805K  [C0805K]
C156  100n  C-EUC0805K  [C0805K]
C157  1n  C-EUC0805K  [C0805K]
C158  10n  C-EUC0805K  [C0805K]
C159  10n  C-EUC0805K  [C0805K]
C160  10n  C-EUC0805K  [C0805K]
C161  10n  C-EUC0805K  [C0805K]
L35  BLM18PG  IND_BLM  [IND_BLM]
L36  0u12H  IND_BLM  [IND_BLM]
L37  0u12H  IND_BLM  [IND_BLM]
P10  L04P  [L04P]
P11  RJ_45  [RJ_45]
R190  47R  R-EU_R0805W  [R0805W]
R191  47R  R-EU_R0805W  [R0805W]
R192  2k  R-EU_R0805W  [R0805W]
R193  1k54  R-EU_R0805W  [R0805W]
R194  0R  R-EU_R0805W  [R0805W]
R195  12k1  R-EU_R0805W  [R0805W]
R196  12k1  R-EU_R0805W  [R0805W]
R197  15k  R-EU_R0805W  [R0805W]
R198  15k  R-EU_R0805W  [R0805W]
R199  15k  R-EU_R0805W  [R0805W]
R200  15k  R-EU_R0805W  [R0805W]
R201  15k  R-EU_R0805W  [R0805W]
R202  330R  R-EU_R0805W  [R0805W]
R203  61R9  R-EU_R0805W  [R0805W]
R204  61R9  R-EU_R0805W  [R0805W]
R205  61R9  R-EU_R0805W  [R0805W]
R206  61R9  R-EU_R0805W  [R0805W]
R207  330R  R-EU_R0805W  [R0805W]
U$127  ICS1893BF  [ISC1893BF]
U$646  TESTPAD  [TESTPAD]
U$647  TESTPAD  [TESTPAD]
U$648  TESTPAD  [TESTPAD]
U$649  TESTPAD  [TESTPAD]
U$650  TESTPAD  [TESTPAD]
U$651  TESTPAD  [TESTPAD]
U$652  TESTPAD  [TESTPAD]
U$653  TESTPAD  [TESTPAD]
U$654  TESTPAD  [TESTPAD]
U$655  TESTPAD  [TESTPAD]
U$656  TESTPAD  [TESTPAD]
U$657  TESTPAD  [TESTPAD]
U$658  TESTPAD  [TESTPAD]
U$659  TESTPAD  [TESTPAD]
U$660  TESTPAD  [TESTPAD]
U$661  TESTPAD  [TESTPAD]
U$662  TESTPAD  [TESTPAD]
U$663  TESTPAD  [TESTPAD]
U$664  TESTPAD  [TESTPAD]
U$665  TESTPAD  [TESTPAD]
U$666  TESTPAD  [TESTPAD]
U$667  TESTPAD  [TESTPAD]
U$668  TESTPAD  [TESTPAD]
U$669  TESTPAD  [TESTPAD]
U$670  TESTPAD  [TESTPAD]
U$671  TESTPAD  [TESTPAD]
U$672  TESTPAD  [TESTPAD]
U$673  TESTPAD  [TESTPAD]
U$674  TESTPAD  [TESTPAD]
U$675  TESTPAD  [TESTPAD]
U$676  TESTPAD  [TESTPAD]
U$677  TESTPAD  [TESTPAD]
U$678  TESTPAD  [TESTPAD]
U$679  TESTPAD  [TESTPAD]
U$680  TESTPAD  [TESTPAD]
U$681  TESTPAD  [TESTPAD]
U$682  TESTPAD  [TESTPAD]
U$683  TESTPAD  [TESTPAD]
U$684  TESTPAD  [TESTPAD]
U$685  TESTPAD  [TESTPAD]
U$686  TESTPAD  [TESTPAD]
U$687  TESTPAD  [TESTPAD]
U$688  TESTPAD  [TESTPAD]
U$689  TESTPAD  [TESTPAD]
U$690  TESTPAD  [TESTPAD]
X4  25MHz  HC49_4H_SMX  [HC49_4H_SMX]

### Nets
0V: C144.2 C145.2 C147.1 C148.2 C149.2 C150.2 C151.2 C152.2 ; supply symbol labelled Z0L ; also sheet 2,3,4,5,6,7,8,9,10,11,12,13,14,16
+3V3: C144.1 C145.1 C148.1 C149.1 C150.1 C151.1 C152.1 L35.P$1 U$127.7(VDD_A) U$127.14(VDD_IO1) U$127.18(VDD_RL) U$127.22(VDD_TL) U$127.24(VDD_TP1) U$127.33(VDD_TP2) U$127.45(VDD_02) U$127.48(VDD_01) U$667.1 ; also sheet 2,3,4,5,6,7,10,11,12,13,14,16
AVTIVITY: P11.12 R201.2 R202.1 U$674.1
ECOLR: U1.P2(GPIO63) U$127.43(COL) U$659.1
ECRSR: U1.R1(GPIO64) U$127.44(CRS) U$660.1
EMDCR: U$127.27(MDC) ; also sheet 14
EMDIOR: R195.2 U1.K2(GPIO50) U$127.26(MDIO) U$646.1
ERCLKR: R191.1 ; also sheet 14
ERD0R: U1.N3(GPIO53) U$127.31(RXD0) U$649.1
ERD1R: U1.N2(GPIO54) U$127.30(RXD1) U$650.1
ERD2R: U1.N1(GPIO55) U$127.29(RXD2) U$651.1
ERD3R: U1.M3(GPIO56) U$127.28(RXD3) U$652.1
ERERR: U1.V1(GPIO52) U$127.35(RX_ER) U$648.1
ERXDVR: U1.U3(GPIO51) U$127.32(RX_DV) U$647.1
ETCLKR: R190.1 ; also sheet 14
ETD0R: U1.L3(GPIO59) U$127.39(TXD0) U$655.1
ETD1R: U1.L1(GPIO60) U$127.40(TXD1) U$656.1
ETD2R: U1.K1(GPIO61) U$127.41(TXD2) U$657.1
ETD3R: U1.K3(GPIO62) U$127.42(TXD3) U$658.1
ETENR: U1.M2(GPIO57) U$127.38(TX_EN) U$653.1
GND1: C155.1 C156.2 C157.2 P11.14 P11.15 P11.16 R192.2 R193.2 R194.2 R197.2 R198.2 R199.2 R200.2 U$127.2(VSS_A) U$127.5(VSS_IO1) U$127.11(VSS_RL) U$127.17(VSS_TL) U$127.21(VSS1) U$127.25(VSS2) U$127.36(VSS3)
LINK: P11.13 R199.1 R207.2 U$680.1
N$237: R190.2 U$127.37(TX_CLK) U$663.1
N$239: U$127.47(REF_IN) X4.2
N$242: C147.2 U$127.46(REF_OUT) X4.1
N$243: R194.1 U$127.10(AMDIX_EN) U$666.1
N$249: R191.2 R193.1 R196.2 U$127.20(100TCSR) U$127.34(RX_CLK) U$662.1 U$665.1
N$250: R192.1 U$127.19(10TCSR) U$664.1
N$251: L35.P$2 P11.11 R195.1 R196.1 R201.1
N$252: R207.1 U$127.4(P2LI) U$671.1
N$253: R198.1 U$127.6(P3TD) U$672.1
N$254: R197.1 U$127.8(P4RD) U$673.1
N$255: R200.1 U$127.3(P1CL) U$670.1
N$256: R202.2 U$127.1(P0AC) U$669.1
N$257: L36.P$2 R203.2 U$675.1
N$258: L36.P$1 R204.1 U$677.1
N$259: U1.M1(GPIO58) U$654.1
N$261: L37.P$2 R205.2 U$678.1
N$262: L37.P$1 R206.1 U$679.1
N$265: C157.1 C158.2 C159.2 C160.2 C161.2 U$676.1
N$266: U$127.13(TP_TXNA)
N$373: U1.P1(GPIO65) U$661.1
N$374: U$127.9(10/100) U$668.1
POE1: C158.1 P10.1 P11.5 U$681.1
POE2: C159.1 P10.2 P11.8 U$688.1
POE3: C160.1 P10.3 P11.10 U$689.1
POE4: C161.1 P10.4 P11.9 U$690.1
RST/: U$127.23(RESET_IN) ; also sheet 14
RXCT: C156.1 P11.7 U$686.1
TXA+: C153.2 P11.1 R203.1 U$127.12(TP_TXPA) U$682.1
TXA-: C153.1 P11.2 R204.2 U$684.1
TXB+: C154.2 P11.3 R205.1 U$127.16(TP_TXPB) U$685.1
TXB-: C154.1 P11.6 R206.2 U$127.15(TP_TNB) U$687.1
TXCT: C155.2 P11.4 U$683.1
Unconnected: C143.1 C143.2 C146.1 C146.2

### Notes on the sheet
- Ethernet PHY
- 2.0

## Sheet 16 of 16
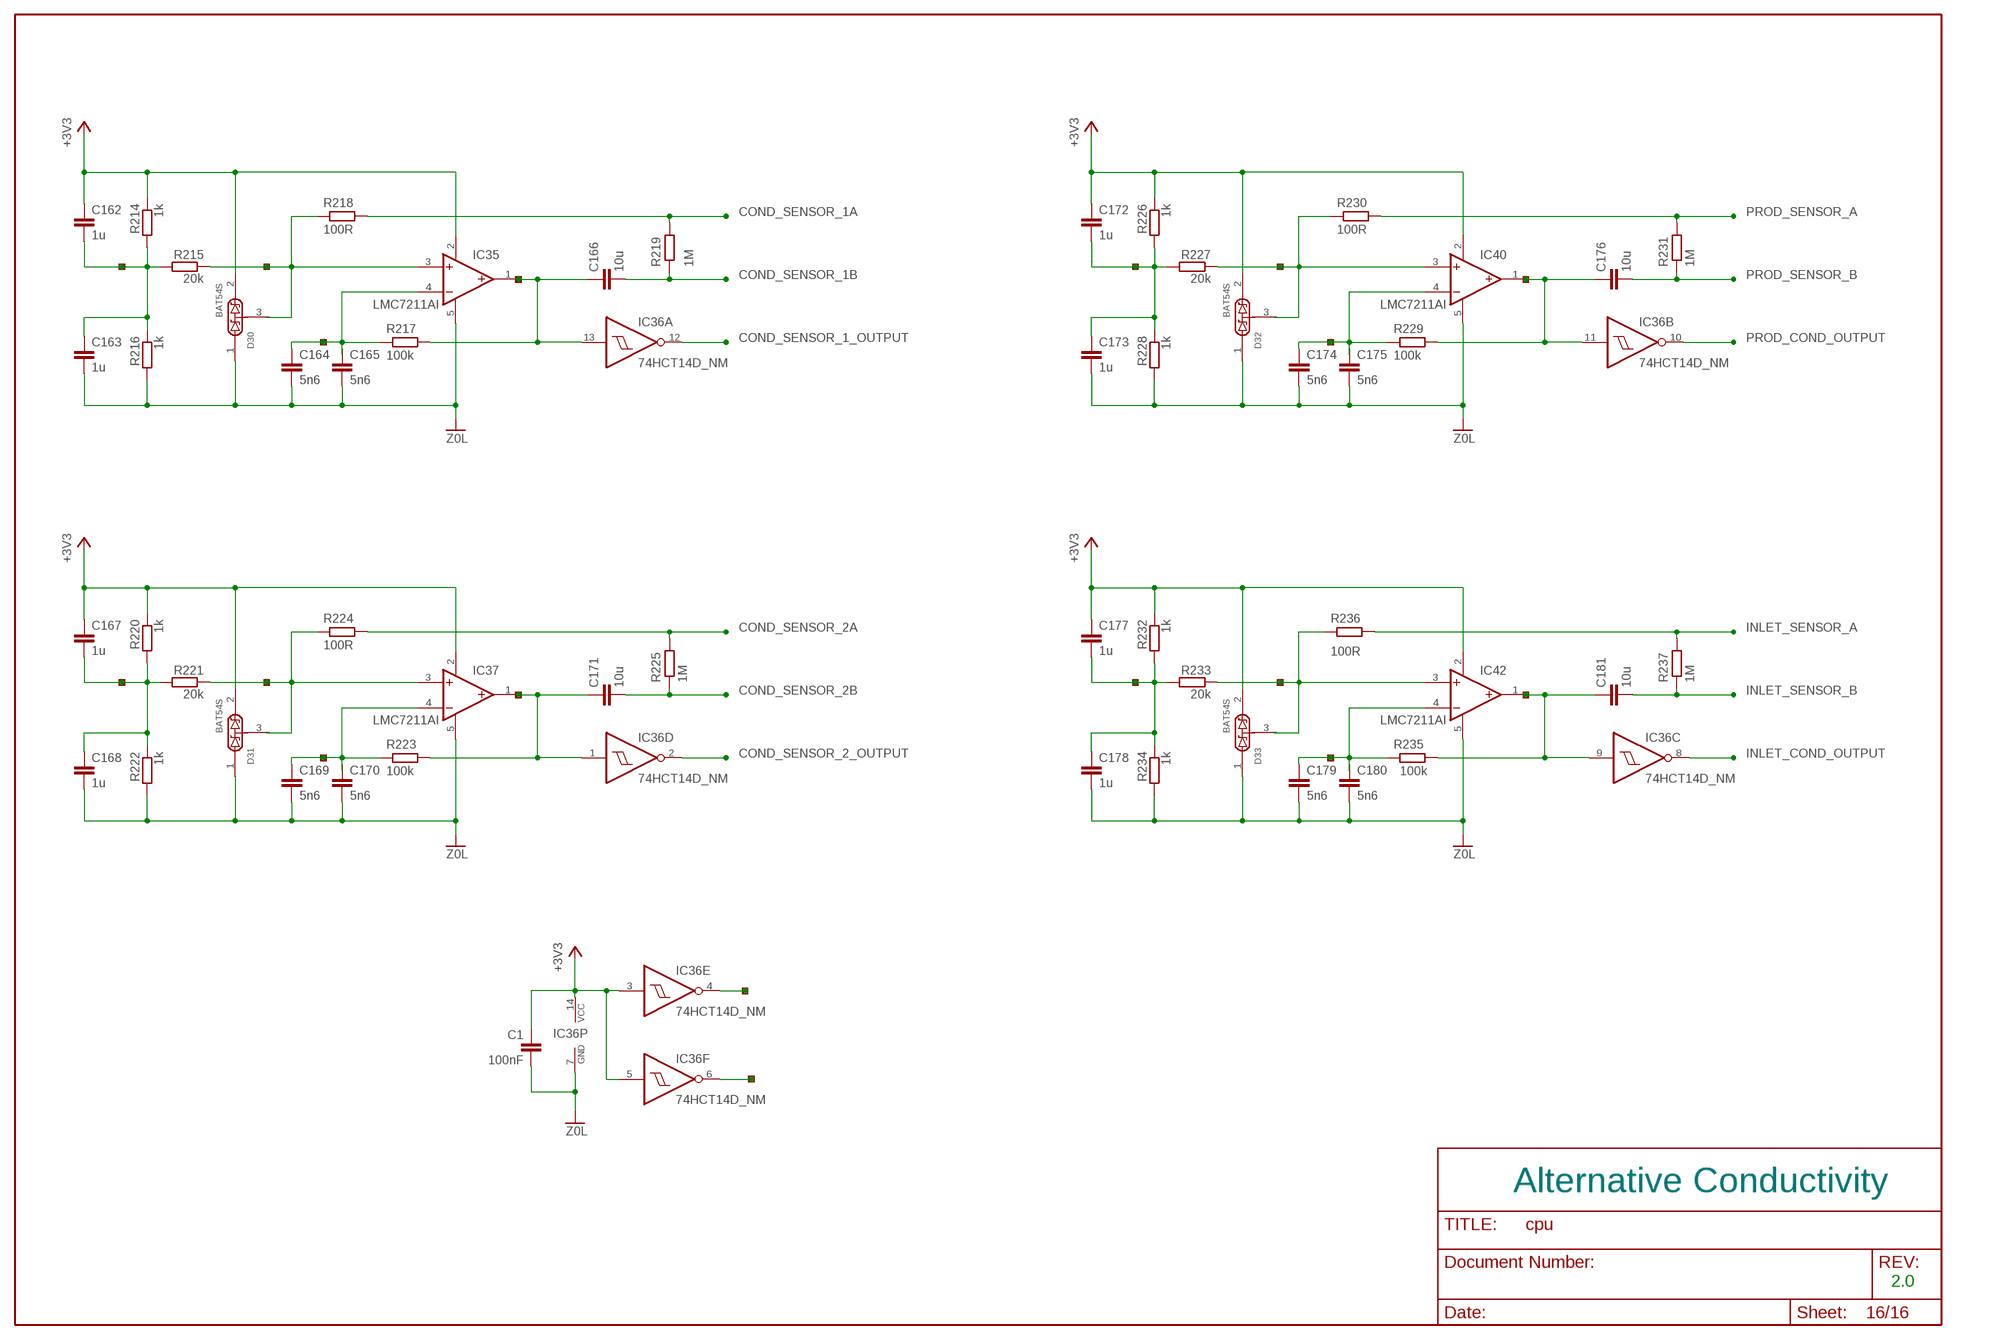
[diagram p19: schematic, sheet 16]

### Parts
C1  100nF  C-EUC0805K  [C0805K]
C162  1u  C-EUC0805K  [C0805K]
C163  1u  C-EUC0805K  [C0805K]
C164  5n6  C-EUC0805K  [C0805K]
C165  5n6  C-EUC0805K  [C0805K]
C166  10u  C-EUC0805K  [C0805K]
C167  1u  C-EUC0805K  [C0805K]
C168  1u  C-EUC0805K  [C0805K]
C169  5n6  C-EUC0805K  [C0805K]
C170  5n6  C-EUC0805K  [C0805K]
C171  10u  C-EUC0805K  [C0805K]
C172  1u  C-EUC0805K  [C0805K]
C173  1u  C-EUC0805K  [C0805K]
C174  5n6  C-EUC0805K  [C0805K]
C175  5n6  C-EUC0805K  [C0805K]
C176  10u  C-EUC0805K  [C0805K]
C177  1u  C-EUC0805K  [C0805K]
C178  1u  C-EUC0805K  [C0805K]
C179  5n6  C-EUC0805K  [C0805K]
C180  5n6  C-EUC0805K  [C0805K]
C181  10u  C-EUC0805K  [C0805K]
D30  BAT54S  [SOT23]
D31  BAT54S  [SOT23]
D32  BAT54S  [SOT23]
D33  BAT54S  [SOT23]
IC35  LMC7211AI  [SOT23-5]
IC36  74HCT14D_NM  74HCT14D  [SO14]
IC37  LMC7211AI  [SOT23-5]
IC40  LMC7211AI  [SOT23-5]
IC42  LMC7211AI  [SOT23-5]
R214  1k  R-EU_R0805W  [R0805W]
R215  20k  R-EU_R0805W  [R0805W]
R216  1k  R-EU_R0805W  [R0805W]
R217  100k  R-EU_R0805W  [R0805W]
R218  100R  R-EU_R0805W  [R0805W]
R219  1M  R-EU_R0805W  [R0805W]
R220  1k  R-EU_R0805W  [R0805W]
R221  20k  R-EU_R0805W  [R0805W]
R222  1k  R-EU_R0805W  [R0805W]
R223  100k  R-EU_R0805W  [R0805W]
R224  100R  R-EU_R0805W  [R0805W]
R225  1M  R-EU_R0805W  [R0805W]
R226  1k  R-EU_R0805W  [R0805W]
R227  20k  R-EU_R0805W  [R0805W]
R228  1k  R-EU_R0805W  [R0805W]
R229  100k  R-EU_R0805W  [R0805W]
R230  100R  R-EU_R0805W  [R0805W]
R231  1M  R-EU_R0805W  [R0805W]
R232  1k  R-EU_R0805W  [R0805W]
R233  20k  R-EU_R0805W  [R0805W]
R234  1k  R-EU_R0805W  [R0805W]
R235  100k  R-EU_R0805W  [R0805W]
R236  100R  R-EU_R0805W  [R0805W]
R237  1M  R-EU_R0805W  [R0805W]
U$144  TESTPAD  [TESTPAD]
U$495  TESTPAD  [TESTPAD]
U$502  TESTPAD  [TESTPAD]
U$504  TESTPAD  [TESTPAD]
U$524  TESTPAD  [TESTPAD]
U$691  TESTPAD  [TESTPAD]
U$692  TESTPAD  [TESTPAD]
U$693  TESTPAD  [TESTPAD]
U$694  TESTPAD  [TESTPAD]
U$695  TESTPAD  [TESTPAD]
U$696  TESTPAD  [TESTPAD]
U$697  TESTPAD  [TESTPAD]
U$699  TESTPAD  [TESTPAD]
U$700  TESTPAD  [TESTPAD]
U$701  TESTPAD  [TESTPAD]
U$702  TESTPAD  [TESTPAD]
U$704  TESTPAD  [TESTPAD]
U$705  TESTPAD  [TESTPAD]

### Nets
0V: C1.2 C163.2 C164.2 C165.2 C168.2 C169.2 C170.2 C173.2 C174.2 C175.2 C178.2 C179.2 C180.2 D30.1 D31.1 D32.1 D33.1 IC35.5(V-) IC36.7(P:GND) IC37.5(V-) IC40.5(V-) IC42.5(V-) R216.2 R222.2 R228.2 R234.2 ; supply symbol labelled Z0L ; also sheet 2,3,4,5,6,7,8,9,10,11,12,13,14,15
+3V3: C1.1 C162.1 C162.2 C163.1 C167.1 C167.2 C168.1 C172.1 C172.2 C173.1 C177.1 C177.2 C178.1 D30.2 D31.2 D32.2 D33.2 IC35.2(V+) IC36.3(E:I) IC36.5(F:I) IC36.14(P:VCC) IC37.2(V+) IC40.2(V+) IC42.2(V+) R214.1 R214.2 R215.2 R216.1 R220.1 R220.2 R221.2 R222.1 R226.1 R226.2 R227.2 R228.1 R232.1 R232.2 R233.2 R234.1 U$693.1 U$697.1 U$700.1 U$702.1 ; also sheet 2,3,4,5,6,7,10,11,12,13,14,15
COND_SENSOR_1_OUTPUT: IC36.12(A:O) ; also sheet 4
COND_SENSOR_1A: R218.2 R219.2 ; also sheet 3,4
COND_SENSOR_1B: C166.2 R219.1 ; also sheet 3
COND_SENSOR_2_OUTPUT: IC36.2(D:O) ; also sheet 4
COND_SENSOR_2A: R224.2 R225.2 ; also sheet 3,4
COND_SENSOR_2B: C171.2 R225.1 ; also sheet 3
INLET_COND_OUTPUT: IC36.8(C:O) ; also sheet 4
INLET_SENSOR_A: R236.2 R237.2
INLET_SENSOR_B: C181.2 R237.1
N$260: D30.3 IC35.3(IN+) R215.1 R218.1 U$699.1
N$263: C164.1 C165.1 IC35.4(IN-) R217.1 U$701.1
N$264: C166.1 IC35.1(OUT) IC36.13(A:I) R217.2 U$144.1
N$267: D31.3 IC37.3(IN+) R221.1 R224.1 U$504.1
N$268: C169.1 C170.1 IC37.4(IN-) R223.1 U$704.1
N$269: C171.1 IC36.1(D:I) IC37.1(OUT) R223.2 U$705.1
N$270: D32.3 IC40.3(IN+) R227.1 R230.1 U$695.1
N$271: C174.1 C175.1 IC40.4(IN-) R229.1 U$696.1
N$272: C176.1 IC36.11(B:I) IC40.1(OUT) R229.2 U$694.1
N$273: D33.3 IC42.3(IN+) R233.1 R236.1 U$691.1
N$274: C179.1 C180.1 IC42.4(IN-) R235.1 U$692.1
N$275: C181.1 IC36.9(C:I) IC42.1(OUT) R235.2 U$495.1
N$297: IC36.4(E:O) U$502.1
N$298: IC36.6(F:O) U$524.1
PROD_COND_OUTPUT: IC36.10(B:O) ; also sheet 4
PROD_SENSOR_A: R230.2 R231.2
PROD_SENSOR_B: C176.2 R231.1

### Notes on the sheet
- Alternative Conductivity
- 2.0

## Library data of the parts
C1-C7 C9-C13 C16-C24 C26 C28-C40 C42-C44 C47 C48 C50-C113 C115-C191 = rcl:C-EU: CAPACITOR, European symbol
C8 C14 C15 C25 C27 C41 C49 C114 = lbm:CAP2.5
C45 C46 = rcl:CPOL-EU: POLARIZED CAPACITOR, European symbol
D1 D2 D13 D19 = lbm:UPT
D3 D6-D12 = lbm:D_DO214AC
D4 D14-D17 D21 D24 = lbm:SM6T
D5 = diode:ZENER-DIODE: Z-Diode
D18 D22 D23 D25-D29 = lbm:BAS16
D30-D33 = lbm:BAT54S
F1-F4 = lbm:T_FILTER
FF1 FF2 = lbm:SN74LUC2G74
G1 = battery:CR2032V: LI BATTERY Varta
IC1-IC4 IC7 IC9 = optocoupler:SFH617G: SIEMENS OPTO COUPLER
IC5 = lbm:DC_DC_TRACO_1W_DUAL
IC6 IC11 IC14 IC36 = 74xx-eu:74*14: Hex schmitt trigger INVERTER
IC8 IC27 = atmel_prototype_header:ATMEGA8: IC AVR MCU 8K LV 8MHZ IND 32TQFP , Atmel Part number ATMEGA8L-8AI
IC10 IC28 = linear:LF347: OP AMP
IC12 = lbm:LM4120
IC13 = 74xx-eu:74*02: Quad 2-input NOR gate
IC15 IC16 = lbm:MAX232A
IC17 = ftdi3:FT232BM: USB UART 2nd Generation USB UART (USB <-> Serial)
IC18 = lbm:DC_DC_TRACO_8W
IC19 = lbm:DC_DC_NMSC
IC20 = 74xx-eu:74*253: Dual 4-to 1 line data SELECTOR/MULTIPLEXER, 3-state
IC21 = microchip:93*: Serial EPROM 1 K/2 K/4 K, low voltage, Microwire
IC22 = lbm:LTC1622
IC23 = lbm:M41T81
IC24 = 74xx-eu:74*573: 8-bit D latch BUS DRIVER
IC25 IC26 = lbm:SDRAM64MB
IC29 = linear:LM339: Low Power Low Offset Voltage Quad Comparators with open collector; LM139/LM239/LM339/LM2901/LM3302
IC30 = microchip:24*: Serial EEPROM I2C
IC31 = lbm:TLC77XX
IC32 = lbm:ICS7152
IC33 = 74xx-eu:74*08: Quad 2-input AND gate
IC34 = lbm:ADM811
IC35 IC37 IC40 IC42 = lbm:LMC7211AI
J1 = jumper:JP2QE: JUMPER
J3 J8 = con-lstb:MA03-2: PIN HEADER
J6 J7 = jumper:JP4E: JUMPER
JTAG1 = lbm:JTAG_HEADER
K2 K4 = relay:SNR?*: Slim PCB Relay 1 pole 6 A SCHRACK Source: http://www.schrack.com/.. 5815.pdf
K5 K6 = relay:GN?*: ULTRA-SMALL PACKAGE SLIM POLARIZED RELAY NAiS Source: http://www.mew-europe.com/.. en_ds_61007_0000.pdf
L1-L3 L10 L12 = lbm:L1210
L4 L6-L9 L26-L37 = lbm:IND_BLM
L11 = rcl:L-EU: INDUCTOR, European symbol
L13-L25 = lbm:BLM18PG
LED1 LED2 = led:LED: LED OSRAM: - CHIPLED LG R971, LG N971, LY N971, LG Q971, LY Q971, LO R971, LY R971 LH N974, LH R974 LS Q976, LO Q976, LY Q976 LO Q996 - Hyper CHIPLED LW Q18S LB Q993, LB Q99A, LB R99A - SideLED LS A670, LO A670, LY A670, LG A670, LP A670 LB A673, LV A673, LT A673, LW A673 LH A674 LY A675 LS A676, LA A676, LO A676, LY A676, LW A676 LS A679, LY A679, LG A679 - Hyper Micro SIDELED® LS Y876, LA Y876, LO Y876, LY Y876 LT Y87S - SmartLED LW L88C, LW L88S LB L89C, LB L89S, LG L890 LS L89K, LO L89K, LY L89K LS L896, LA L896, LO L896, LY L896 - TOPLED LS T670, LO T670, LY T670, LG T670, LP T670 LSG T670, LSP T670, LSY T670, LOP T670, LYG T670 LG T671, LOG T671, LSG T671 LB T673, LV T673, LT T673, LW T673 LH T674 LS T676, LA T676, LO T676, LY T676, LB T676, LH T676, LSB T676, LW T676 LB T67C, LV T67C, LT T67C, LS T67K, LO T67K, LY T67K, LW E67C LS E67B, LA E67B, LO E67B, LY E67B, LB E67C, LV E67C, LT E67C LW T67C LS T679, LY T679, LG T679 LS T770, LO T770, LY T770, LG T770, LP T770 LB T773, LV T773, LT T773, LW T773 LH T774 LS E675, LA E675, LY E675, LS T675 LS T776, LA T776, LO T776, LY T776, LB T776 LHGB T686 LT T68C, LB T68C - Hyper Mini TOPLED® LB M676 - Mini TOPLED Santana® LG M470 LS M47K, LO M47K, LY M47K Source: http://www.osram.convergy.de/
P1 = con-amp-mt:L02P: AMP MT CONNECTOR
P2 P9 P10 = con-amp-mt:L04P: AMP MT CONNECTOR
P3 = lbm:MODU30
P4 = con-weidmueller-sl35:90-2: WEIDMUELLER CLAMP CONNECTOR
P5 P8 = lbm:MODU16
P6 = lbm:MODU44
P11 = lbm:RJ_45
Q1 Q2 Q10 Q11 Q13 Q14 Q16 Q18 Q29-Q31 = transistor-small-signal:BSS123: N-CHANNEL MOS FET
Q3 Q7 = lbm:IRF7455
Q4 = zetex:NPNSOT23: NPN TRANSISTOR
Q5 Q6 Q8 = irf-2:IRF7103: HEXFET® Power MOSFET Adavanced Process Technology Ultra Low On-Resistance Dual N-Channel MOSFET Surface Mount Available in Tape & Reel Dynamic dv/dt Rating Fast Switching Please connect both Drain-Pins of each FET for thermal Reasons! (Pin 5 with Pin 6, 7 with 8)
Q9 = lbm:P-FET-DPAK
Q12 = transistor-small-signal:BSS84: P-CHANNEL MOS FET
Q15 Q19 = lbm:IRF7422
Q17 = transistor-small-signal:BC327: PNP TRANSISTOR
R1-R207 R214-R241 = rcl:R-EU_: RESISTOR, European symbol
U1 = lbm:NS9360
U$10 U$13 U$21-U$23 U$25 U$30 U$31 U$37 U$40 U$49-U$52 U$54 U$55 U$57 U$60 U$64 U$65 U$68 U$69 U$73-U$76 U$80 U$82-U$84 U$92 U$99 U$101 U$140-U$394 U$396-U$497 U$502 U$504 U$509-U$540 U$542-U$636 U$638-U$697 U$699-U$702 U$704 U$705 = lbm:TESTPAD
U$93 = lbm:FLASH_M29DW640D
U$113 = lbm:LP3982
U$127 = lbm:ICS1893BF
X1 = lbm:MURATA_RESONATOR
X2 = crystal:CRYTAL: CRYSTAL
X3 X4 = lbm:HC49_4H_SMX
Z1-Z13 = lbm:EMI_FILTER_22PF/200-MA